# Altium schematic sheet Relay_SCH.SchDoc
size A
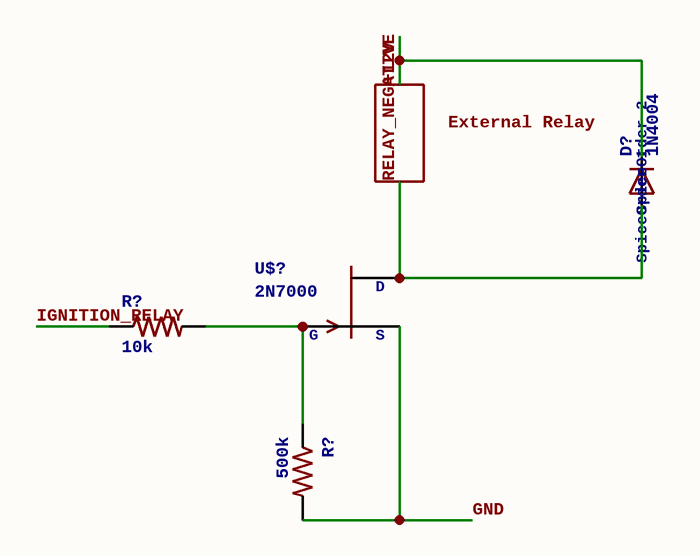
[diagram p0: Relay_SCH.SchDoc]

## Parts
(Parts that share a designator on the sheet are numbered #1, #2 ... from top to bottom, then left to right.)
D?  1N4004  SpiceOrder1: SpiceOrder 1  SpiceOrder2: SpiceOrder 2  [DO41-10]
R?#1  10k  [R0805]
R?#2  500k  [R0805]
U$?  2N7000  [SOT23]

## Nets
+12V: D?.C
GND: R?#2.2 U$?.2(S)
IGNITION_RELAY: R?#1.1
RELAY_NEGATIVE: D?.A U$?.3(D)
NetR?#1_2: R?#1.2 R?#2.1 U$?.1(G)

## Notes on the sheet
- (near D?) External Relay

## Library data of the parts
D? = 1N4004: DIODEgeneral purpose rectifier, 1 A; GateName_1: 1; SymbolName_1: D; LibraryName: diode; DeviceSetName: 1N4004
R?#1 R?#2 = R-US_R0805: RESISTOR, American symbol; GateName_1: G$1; SymbolName_1: R-US; DeviceSetName: R-US_; DeviceName: R0805; LibraryName: rcl
U$? = 2N7000: GateName_1: G$1; SymbolName_1: JFET-N; LibraryName: transistor-fet-extra; DeviceSetName: 2N7000; D: D; S: S; G: G